# Altium schematic sheet VNA_3.SchDoc: VNA
size 409 x 289 mm; Origin: Eagle; OriginPath: C:\Users\Ground Lab\Desktop\LibreVNA\Hardware\Eagle\VNA.sch; OriginSheet: 4; Date: 04.05.2025 20:03:37; SheetNumber: 4; GateName_1: G$1; SymbolName_1: A3L-LOC; LibraryName: VNA; DeviceSetName: A3L-LOC; Sheet: Sheet:
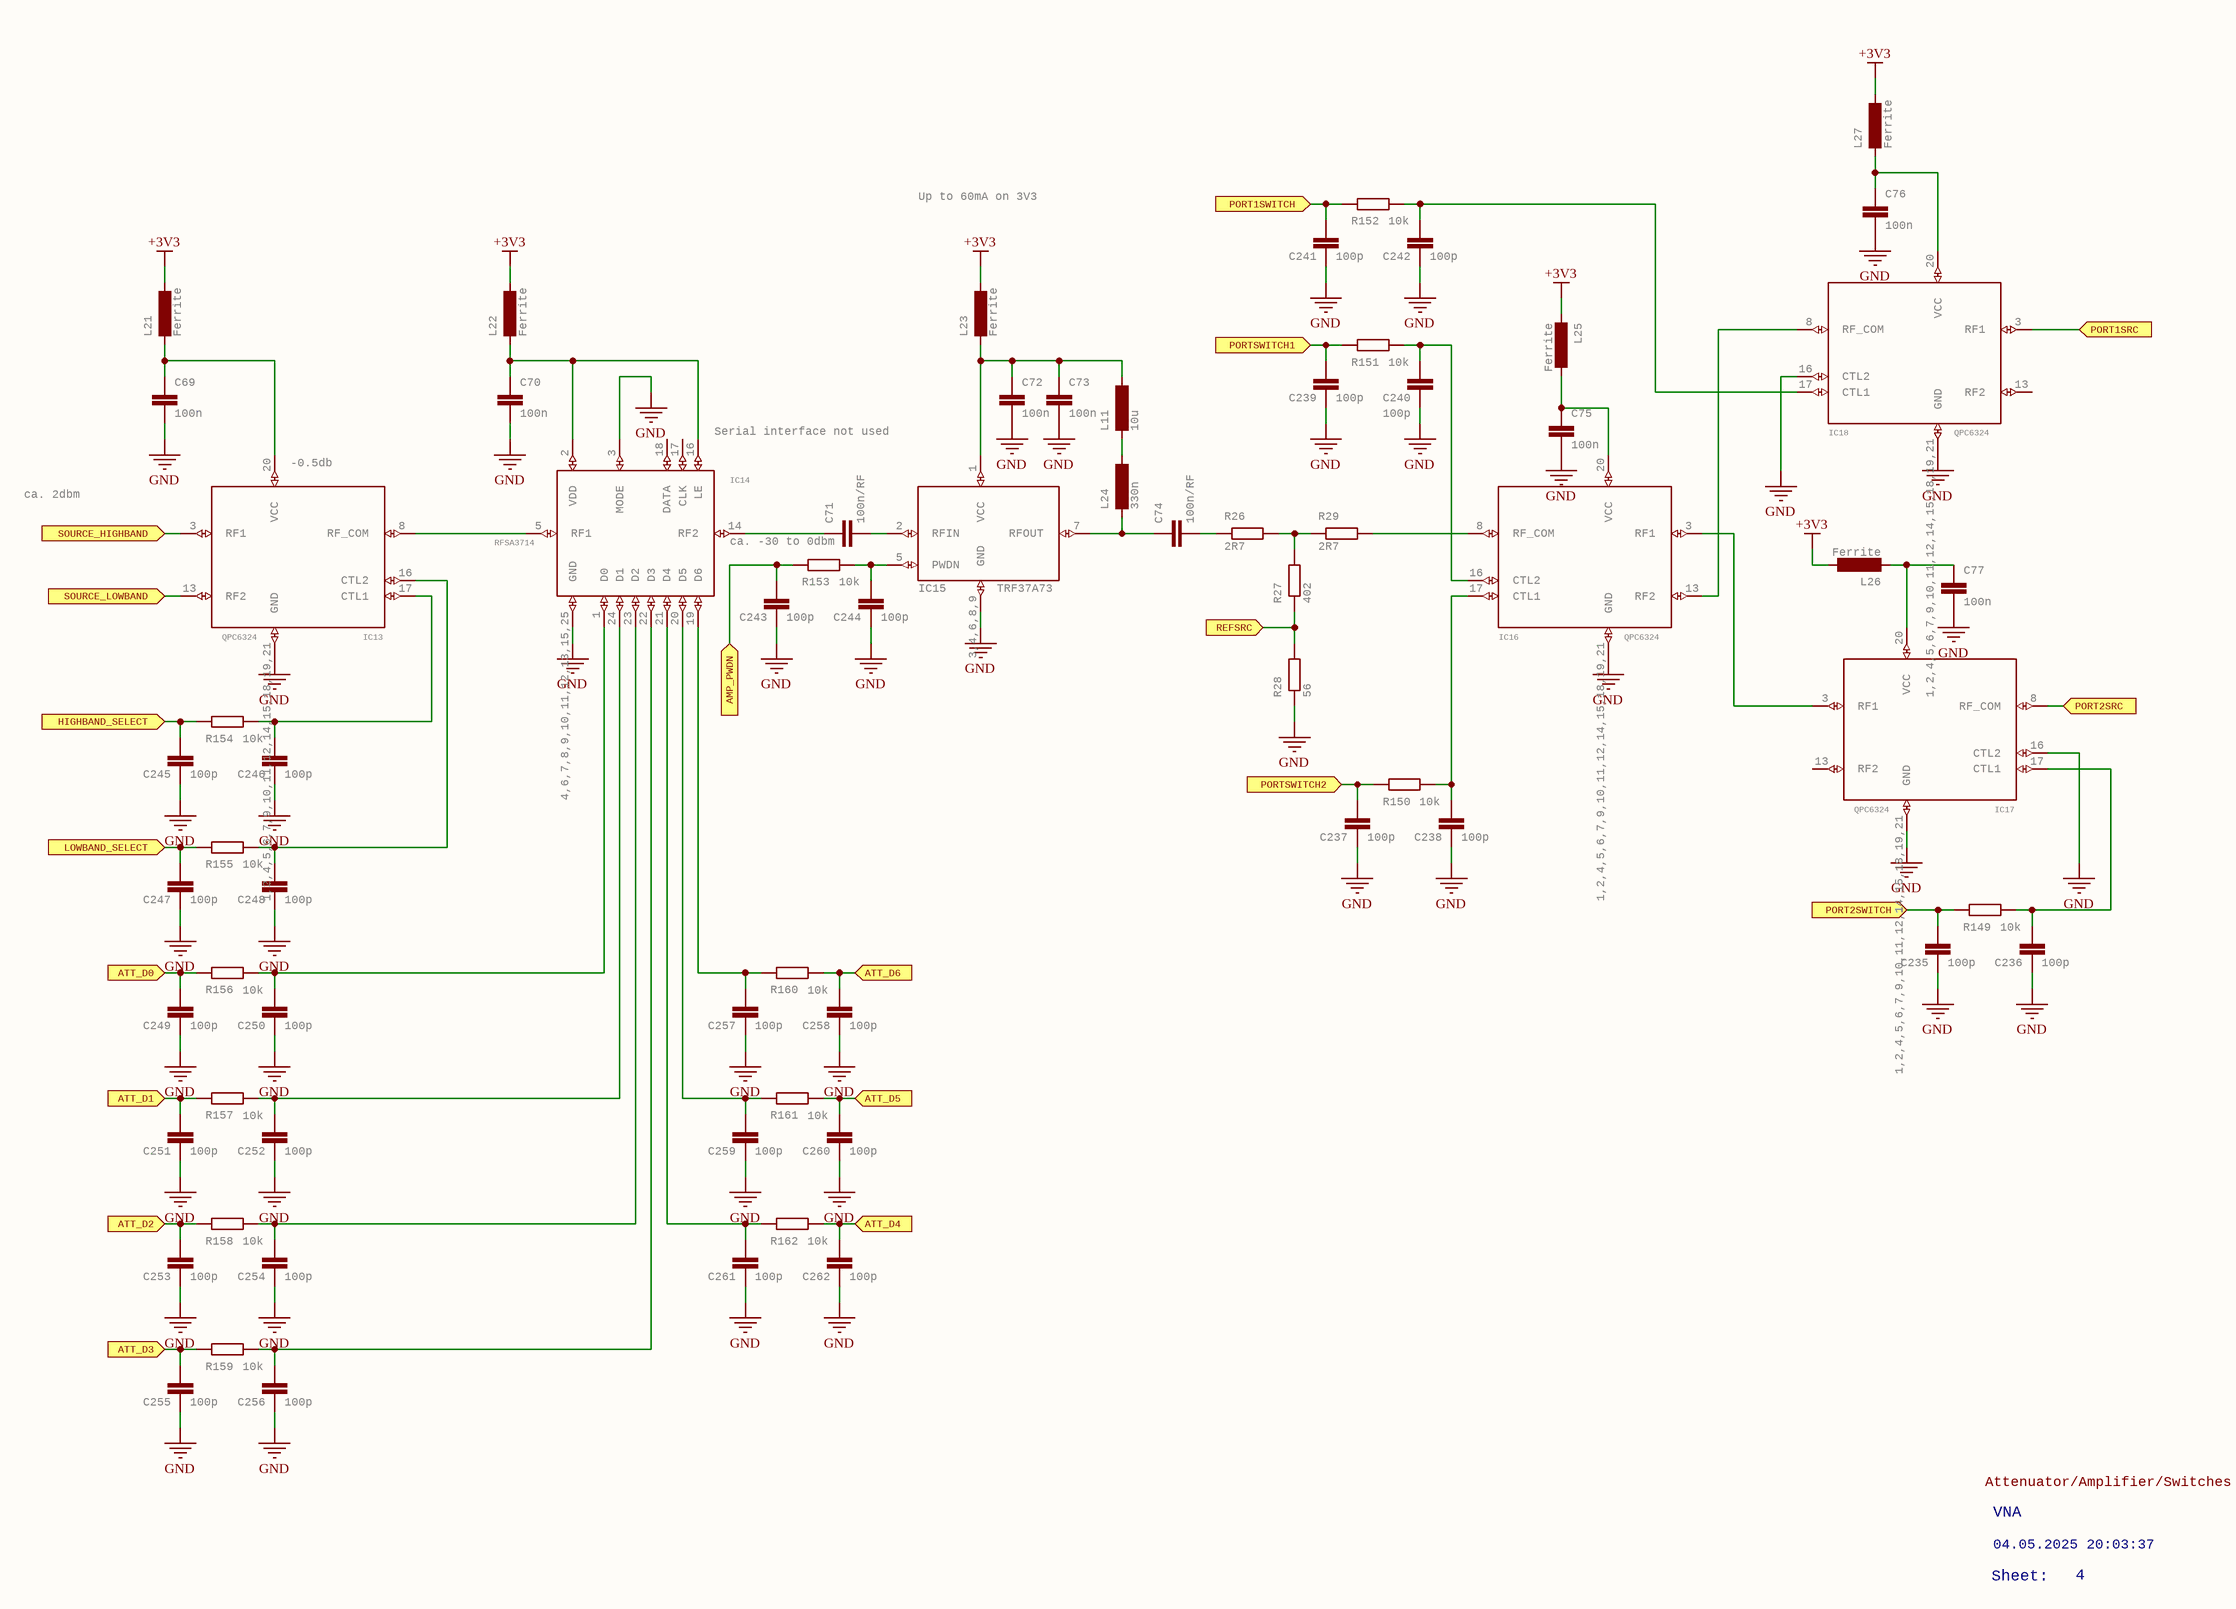
[diagram p0: VNA_3.SchDoc]

## Parts
C69  100n  [C0402]
C70  100n  [C0402]
C71  100n/RF  [C0402]
C72  100n  [C0402]
C73  100n  [C0402]
C74  100n/RF  [C0402]
C75  100n  [C0402]
C76  100n  [C0402]
C77  100n  [C0402]
C235  100p  [C0402]
C236  100p  [C0402]
C237  100p  [C0402]
C238  100p  [C0402]
C239  100p  [C0402]
C240  100p  [C0402]
C241  100p  [C0402]
C242  100p  [C0402]
C243  100p  [C0402]
C244  100p  [C0402]
C245  100p  [C0402]
C246  100p  [C0402]
C247  100p  [C0402]
C248  100p  [C0402]
C249  100p  [C0402]
C250  100p  [C0402]
C251  100p  [C0402]
C252  100p  [C0402]
C253  100p  [C0402]
C254  100p  [C0402]
C255  100p  [C0402]
C256  100p  [C0402]
C257  100p  [C0402]
C258  100p  [C0402]
C259  100p  [C0402]
C260  100p  [C0402]
C261  100p  [C0402]
C262  100p  [C0402]
IC13  QPC6324  [QFN50P400X400X75-21T206]
IC14  RFSA3714  [QFN50P400X400X75-25T270]
IC15  TRF37A73  [SON50P200X200X80-9T90X160N]
IC16  QPC6324  [QFN50P400X400X75-21T206]
IC17  QPC6324  [QFN50P400X400X75-21T206]
IC18  QPC6324  [QFN50P400X400X75-21T206]
L11  10u  [INDC2012X100N]
L21  Ferrite  [R0402]
L22  Ferrite  [R0402]
L23  Ferrite  [R0402]
L24  330n  [L0402]
L25  Ferrite  [R0402]
L26  Ferrite  [R0402]
L27  Ferrite  [R0402]
R26  2R7  [R0402]
R27  402  [R0402]
R28  56  [R0402]
R29  2R7  [R0402]
R149  10k  [R0402]
R150  10k  [R0402]
R151  10k  [R0402]
R152  10k  [R0402]
R153  10k  [R0402]
R154  10k  [R0402]
R155  10k  [R0402]
R156  10k  [R0402]
R157  10k  [R0402]
R158  10k  [R0402]
R159  10k  [R0402]
R160  10k  [R0402]
R161  10k  [R0402]
R162  10k  [R0402]

## Ports
AMP_PWDN (in), ATT_D0 (in), ATT_D1 (in), ATT_D2 (in), ATT_D3 (in), ATT_D4 (in), ATT_D5 (in), ATT_D6 (in), HIGHBAND_SELECT (in), LOWBAND_SELECT (in), PORT1SRC (in), PORT1SWITCH (in), PORT2SRC (in), PORT2SWITCH (in), PORTSWITCH1 (in), PORTSWITCH2 (in), REFSRC (in), SOURCE_HIGHBAND (in), SOURCE_LOWBAND (in)

## Nets
+3V3: L21.1 L22.1 L23.1 L25.2 L26.1 L27.1
GND: C69.2 C70.2 C72.2 C73.2 C75.2 C76.2 C77.2 C235.2 C236.1 C236.2 C237.2 C238.2 C239.2 C240.2 C241.2 C242.2 C243.2 C244.2 C245.2 C246.2 C247.2 C248.2 C249.2 C250.2 C251.2 C252.2 C253.2 C254.2 C255.2 C256.2 C257.2 C258.2 C259.2 C260.2 C261.2 C262.2 IC13.1,2,4,5,6,7,9,10,11,12,14,15,18,19,21(GND) IC14.3(MODE) IC14.4,6,7,8,9,10,11,12,13,15,25(GND) IC15.3,4,6,8,9(GND) IC16.1,2,4,5,6,7,9,10,11,12,14,15,18,19,21(GND) IC17.1,2,4,5,6,7,9,10,11,12,14,15,18,19,21(GND) IC17.16(CTL2) IC17.17(CTL1) IC18.1,2,4,5,6,7,9,10,11,12,14,15,18,19,21(GND) IC18.16(CTL2) R28.1 R149.1
AMP_PWDN: C243.1 R153.2 ; port AMP_PWDN
ATT_D0: C249.1 R156.2 ; port ATT_D0
ATT_D1: C251.1 R157.2 ; port ATT_D1
ATT_D2: C253.1 R158.2 ; port ATT_D2
ATT_D3: C255.1 R159.2 ; port ATT_D3
ATT_D4: C262.1 R162.1 ; port ATT_D4
ATT_D5: C260.1 R161.1 ; port ATT_D5
ATT_D6: C258.1 R160.1 ; port ATT_D6
HIGHBAND_SELECT: C245.1 R154.2 ; port HIGHBAND_SELECT
LOWBAND_SELECT: C247.1 R155.2 ; port LOWBAND_SELECT
PORT1SRC: IC18.3(RF1) ; port PORT1SRC
PORT1SWITCH: C241.1 R152.2 ; port PORT1SWITCH
PORT2SRC: IC17.8(RF_COM) ; port PORT2SRC
PORT2SWITCH: C235.1 R149.2 ; port PORT2SWITCH
PORTSWITCH1: C239.1 R151.2 ; port PORTSWITCH1
PORTSWITCH2: C237.1 R150.2 ; port PORTSWITCH2
REFSRC: R27.1 R28.2 ; port REFSRC
SOURCE_HIGHBAND: IC13.3(RF1) ; port SOURCE_HIGHBAND
SOURCE_LOWBAND: IC13.13(RF2) ; port SOURCE_LOWBAND
NetC69_1: C69.1 IC13.20(VCC) L21.2
NetC70_1: C70.1 IC14.2(VDD) IC14.16(LE) L22.2
NetC71_1: C71.1 IC14.14(RF2)
NetC71_2: C71.2 IC15.2(RFIN)
NetC72_1: C72.1 C73.1 IC15.1(VCC) L11.1 L23.2
NetC74_1: C74.1 IC15.7(RFOUT) L24.2
NetC74_2: C74.2 R26.1
NetC75_1: C75.1 IC16.20(VCC) L25.1
NetC76_1: C76.1 IC18.20(VCC) L27.2
NetC77_1: C77.1 IC17.20(VCC) L26.2
NetC238_1: C238.1 IC16.17(CTL1) R150.1
NetC240_1: C240.1 IC16.16(CTL2) R151.1
NetC242_1: C242.1 IC18.17(CTL1) R152.1
NetC244_1: C244.1 IC15.5(PWDN) R153.1
NetC246_1: C246.1 IC13.17(CTL1) R154.1
NetC248_1: C248.1 IC13.16(CTL2) R155.1
NetC250_1: C250.1 IC14.1(D0) R156.1
NetC252_1: C252.1 IC14.24(D1) R157.1
NetC254_1: C254.1 IC14.23(D2) R158.1
NetC256_1: C256.1 IC14.22(D3) R159.1
NetC257_1: C257.1 IC14.19(D6) R160.2
NetC259_1: C259.1 IC14.20(D5) R161.2
NetC261_1: C261.1 IC14.21(D4) R162.2
NetIC13_8: IC13.8(RF_COM) IC14.5(RF1)
NetIC16_3: IC16.3(RF1) IC17.3(RF1)
NetIC16_8: IC16.8(RF_COM) R29.2
NetIC16_13: IC16.13(RF2) IC18.8(RF_COM)
NetL11_2: L11.2 L24.1
NetR26_2: R26.2 R27.2 R29.1

Not connected (* = marked no-connect by the designer): IC14 17(CLK) 18(DATA); IC17 13(RF2); IC18 13(RF2)

## Notes on the sheet
- Up to 60mA on 3V3
- (near IC14) Serial interface not used
- ca. 2dbm
- (near IC13) -0.5db
- ca. -30 to 0dbm
- Attenuator/Amplifier/Switches
- VNA
- Sheet:
- 04.05.2025 20:03:37
- 4

## Library data of the parts
C69-C77 C235-C262 = C-EU*?:2C0402: CAPACITOR, European symbol; GateName_1: G$1; SymbolName_1: C-EU:1; DeviceName: C0402; LibraryName: VNA; DeviceSetName: C-EU*?:2
IC13 IC16-IC18 = QPC6324: GateName_1: G$1; SymbolName_1: QPC6324; LibraryName: VNA; DeviceSetName: QPC6324
IC14 = RFSA3714: GateName_1: G$1; SymbolName_1: F1958; LibraryName: VNA; DeviceSetName: RFSA3714
IC15 = TRF37A73: GateName_1: G$1; SymbolName_1: AMPLIFIER_PWDN; LibraryName: VNA; DeviceSetName: TRF37A73
L11 = INDUCTOR: GateName_1: G$1; SymbolName_1: L-EU:1; LibraryName: VNA; DeviceSetName: INDUCTOR
L21-L23 L25-L27 = FERRITE: GateName_1: G$1; SymbolName_1: L-EU:1; LibraryName: VNA; DeviceSetName: FERRITE
L24 = INDUCTOR0402: GateName_1: G$1; SymbolName_1: L-EU:1; DeviceName: 0402; LibraryName: VNA; DeviceSetName: INDUCTOR
R26-R29 R149-R162 = R-EU_R0402: RESISTOR, European symbol; GateName_1: G$1; SymbolName_1: R-EU; DeviceSetName: R-EU_; DeviceName: R0402; LibraryName: VNA